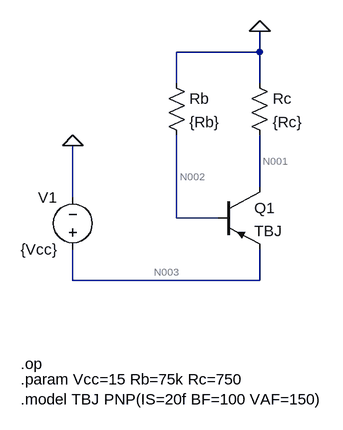
[diagram p0: schematic Q04 - Questão 1.asc]
Q04 - Questão 1.asc, the LTspice schematic file:
Version 4.1
SHEET 1 880 680
WIRE 368 0 368 -32
WIRE 368 0 240 0
WIRE 240 48 240 0
WIRE 368 48 368 0
WIRE 368 208 368 128
WIRE 80 224 80 144
WIRE 240 256 240 128
WIRE 304 256 240 256
WIRE 80 352 80 304
WIRE 368 352 368 304
WIRE 368 352 80 352
FLAG 80 144 0
FLAG 368 -32 0
SYMBOL voltage 80 320 R180
WINDOW 0 24 96 Left 2
WINDOW 3 24 16 Left 2
WINDOW 123 0 0 Left 0
WINDOW 39 0 0 Left 0
SYMATTR InstName V1
SYMATTR Value {Vcc}
SYMBOL pnp 304 208 R0
SYMATTR InstName Q1
SYMATTR Value TBJ
SYMBOL res 224 32 R0
SYMATTR InstName Rb
SYMATTR Value {Rb}
SYMBOL res 352 32 R0
SYMATTR InstName Rc
SYMATTR Value {Rc}
TEXT 0 504 Left 2 !.param Vcc=15 Rb=75k Rc=750\n.model TBJ PNP(IS=20f BF=100 VAF=150)
TEXT 0 480 Left 2 !.op

The netlist it stands for:
* Q04 - Questão 1.asc
V1 N003 0 {Vcc}
Q1 N001 N002 N003 0 TBJ
Rb 0 N002 {Rb}
Rc 0 N001 {Rc}
.model NPN NPN
.model PNP PNP
.lib standard.bjt
.param Vcc=15 Rb=75k Rc=750
.model TBJ PNP(IS=20f BF=100 VAF=150)
.op
.backanno
.end

* Results of the author's LTspice run, read from the files saved beside the schematic
* Operating Point:
*   V(n003) = 15 V
*   V(n001) = 14.29 V
*   V(n002) = 14.29 V
*   Ic(Q1) = -19.05 mA
*   Ib(Q1) = -190.5 µA
*   Ie(Q1) = 19.24 mA
*   I(Rc) = -19.05 mA
*   I(Rb) = -190.5 µA
*   I(V1) = -19.24 mA
* From the log:
*   Semiconductor Device Operating Points:
*                           --- Bipolar Transistors ---
*   Name:       q1
*   Model:      tbj
*   Ib:      -1.90e-04
*   Ic:      -1.90e-02
*   Vbe:     -7.13e-01
*   Vbc:      4.89e-08
*   Vce:     -7.13e-01
*   BetaDC:   1.00e+02
*   Gm:       7.36e-01
*   Rpi:      1.36e+02
*   Rx:       0.00e+00
*   Ro:       7.87e+03
*   Cbe:      0.00e+00
*   Cbc:      0.00e+00
*   Cjs:      0.00e+00
*   BetaAC:   1.00e+02
*   Cbx:      0.00e+00
*   Ft:       0.00e+00